# EAGLE design cv10_dobes (EAGLE 7.7.0)
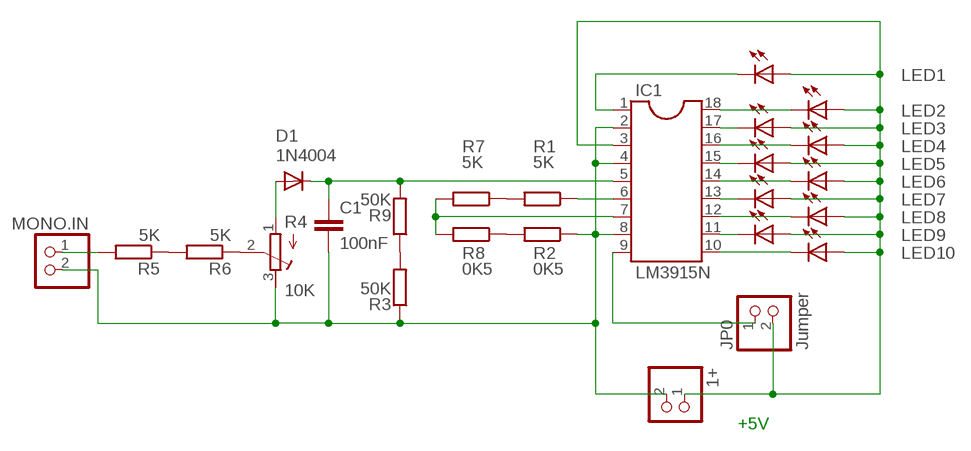
[diagram p0: schematic, sheet 1]

## Parts
1+  PINHD-1X2  [1X02]
C1  100nF  C-EU050-030X075  [C050-030X075]
D1  1N4004  [DO41-10]
IC1  LM3915N  DIL18S  [SOCKET-18]
JP0  Jumper  PINHD-1X2  [1X02]
LED1  LED5MM  [LED5MM]
LED2  LED5MM  [LED5MM]
LED3  LED5MM  [LED5MM]
LED4  LED5MM  [LED5MM]
LED5  LED5MM  [LED5MM]
LED6  LED5MM  [LED5MM]
LED7  LED5MM  [LED5MM]
LED8  LED5MM  [LED5MM]
LED9  LED5MM  [LED5MM]
LED10  LED5MM  [LED5MM]
MONO.IN  PINHD-1X2  [1X02]
R1  5K  R-EU_0207/7  [0207/7]
R2  0K5  R-EU_0207/7  [0207/7]
R3  50K  R-EU_0207/7  [0207/7]
R4  10K  R-TRIMM64P  [RTRIM64P]
R5  5K  R-EU_0207/7  [0207/7]
R6  5K  R-EU_0207/7  [0207/7]
R7  5K  R-EU_0207/7  [0207/7]
R8  0K5  R-EU_0207/7  [0207/7]
R9  50K  R-EU_0207/7  [0207/7]

## Nets
N$1: MONO.IN.1 R5.2
N$2: R4.2(S) R6.1
N$3: D1.A R4.1(E)
N$4: C1.1 D1.C IC1.5 R9.2
N$5: IC1.7 R7.2 R8.2
N$6: IC1.9 JP0.1
N$7: IC1.6 R1.1
N$8: R5.1 R6.2
N$9: 1+.2 C1.2 IC1.2 IC1.4 IC1.8 MONO.IN.2 R2.1 R3.1 R4.3(A)
N$10: 1+.1 IC1.3 JP0.2 LED1.A LED2.A LED3.A LED4.A LED5.A LED6.A LED7.A LED8.A LED9.A LED10.A
N$11: IC1.1 LED1.K(C)
N$12: IC1.18 LED2.K(C)
N$13: IC1.17 LED3.K(C)
N$14: IC1.16 LED4.K(C)
N$15: IC1.15 LED5.K(C)
N$16: IC1.14 LED6.K(C)
N$17: IC1.13 LED7.K(C)
N$18: IC1.12 LED8.K(C)
N$19: IC1.11 LED9.K(C)
N$20: IC1.10 LED10.K(C)
N$21: R2.2 R8.1
N$22: R1.2 R7.1
N$23: R3.2 R9.1

## Notes on the sheet
- +5V

## Library data of the parts
1+ JP0 MONO.IN = pinhead:PINHD-1X2: PIN HEADER
C1 = rcl:C-EU: CAPACITOR, European symbol
D1 = diode:1N4004: DIODE general purpose rectifier, 1 A
IC1 = ic-package:DIL18: Dual In Line / Socket
LED1-LED10 = led:LED: LED OSRAM: - CHIPLED LG R971, LG N971, LY N971, LG Q971, LY Q971, LO R971, LY R971 LH N974, LH R974 LS Q976, LO Q976, LY Q976 LO Q996 - Hyper CHIPLED LW Q18S LB Q993, LB Q99A, LB R99A - SideLED LS A670, LO A670, LY A670, LG A670, LP A670 LB A673, LV A673, LT A673, LW A673 LH A674 LY A675 LS A676, LA A676, LO A676, LY A676, LW A676 LS A679, LY A679, LG A679 - Hyper Micro SIDELED® LS Y876, LA Y876, LO Y876, LY Y876 LT Y87S - SmartLED LW L88C, LW L88S LB L89C, LB L89S, LG L890 LS L89K, LO L89K, LY L89K LS L896, LA L896, LO L896, LY L896 - TOPLED LS T670, LO T670, LY T670, LG T670, LP T670 LSG T670, LSP T670, LSY T670, LOP T670, LYG T670 LG T671, LOG T671, LSG T671 LB T673, LV T673, LT T673, LW T673 LH T674 LS T676, LA T676, LO T676, LY T676, LB T676, LH T676, LSB T676, LW T676 LB T67C, LV T67C, LT T67C, LS T67K, LO T67K, LY T67K, LW E67C LS E67B, LA E67B, LO E67B, LY E67B, LB E67C, LV E67C, LT E67C LW T67C LS T679, LY T679, LG T679 LS T770, LO T770, LY T770, LG T770, LP T770 LB T773, LV T773, LT T773, LW T773 LH T774 LS E675, LA E675, LY E675, LS T675 LS T776, LA T776, LO T776, LY T776, LB T776 LHGB T686 LT T68C, LB T68C - Hyper Mini TOPLED® LB M676 - Mini TOPLED Santana® LG M470 LS M47K, LO M47K, LY M47K Source: http://www.osram.convergy.de LUXEON: - LUMILED® LXK2-PW12-R00, LXK2-PW12-S00, LXK2-PW14-U00, LXK2-PW14-V00 LXK2-PM12-R00, LXK2-PM12-S00, LXK2-PM14-U00 LXK2-PE12-Q00, LXK2-PE12-R00, LXK2-PE12-S00, LXK2-PE14-T00, LXK2-PE14-U00 LXK2-PB12-K00, LXK2-PB12-L00, LXK2-PB12-M00, LXK2-PB14-N00, LXK2-PB14-P00, LXK2-PB14-Q00 LXK2-PR12-L00, LXK2-PR12-M00, LXK2-PR14-Q00, LXK2-PR14-R00 LXK2-PD12-Q00, LXK2-PD12-R00, LXK2-PD12-S00 LXK2-PH12-R00, LXK2-PH12-S00 LXK2-PL12-P00, LXK2-PL12-Q00, LXK2-PL12-R00 Source: www.luxeon.com KINGBRIGHT: KA-3528ASYC Source: www.kingbright.com
R1-R3 R5-R9 = rcl:R-EU_: RESISTOR, European symbol
R4 = rcl:R-TRIMM: Trimm resistor

## Board
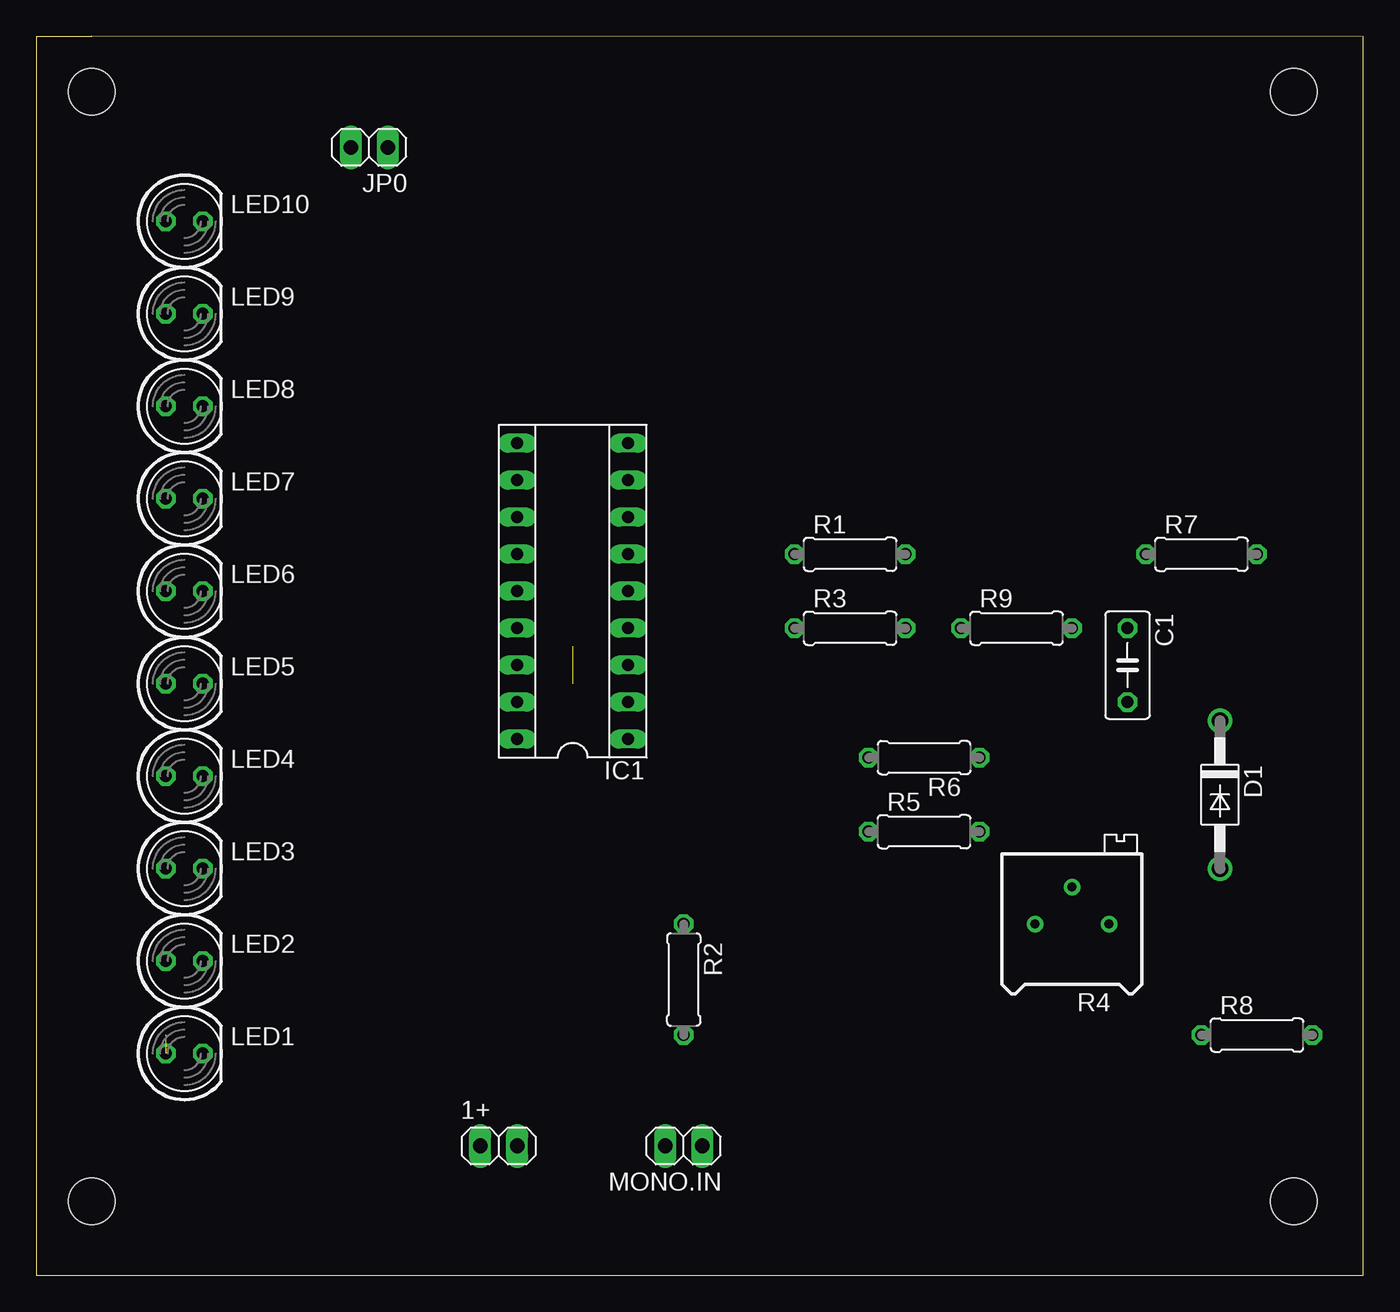
[diagram p1: board, top side]
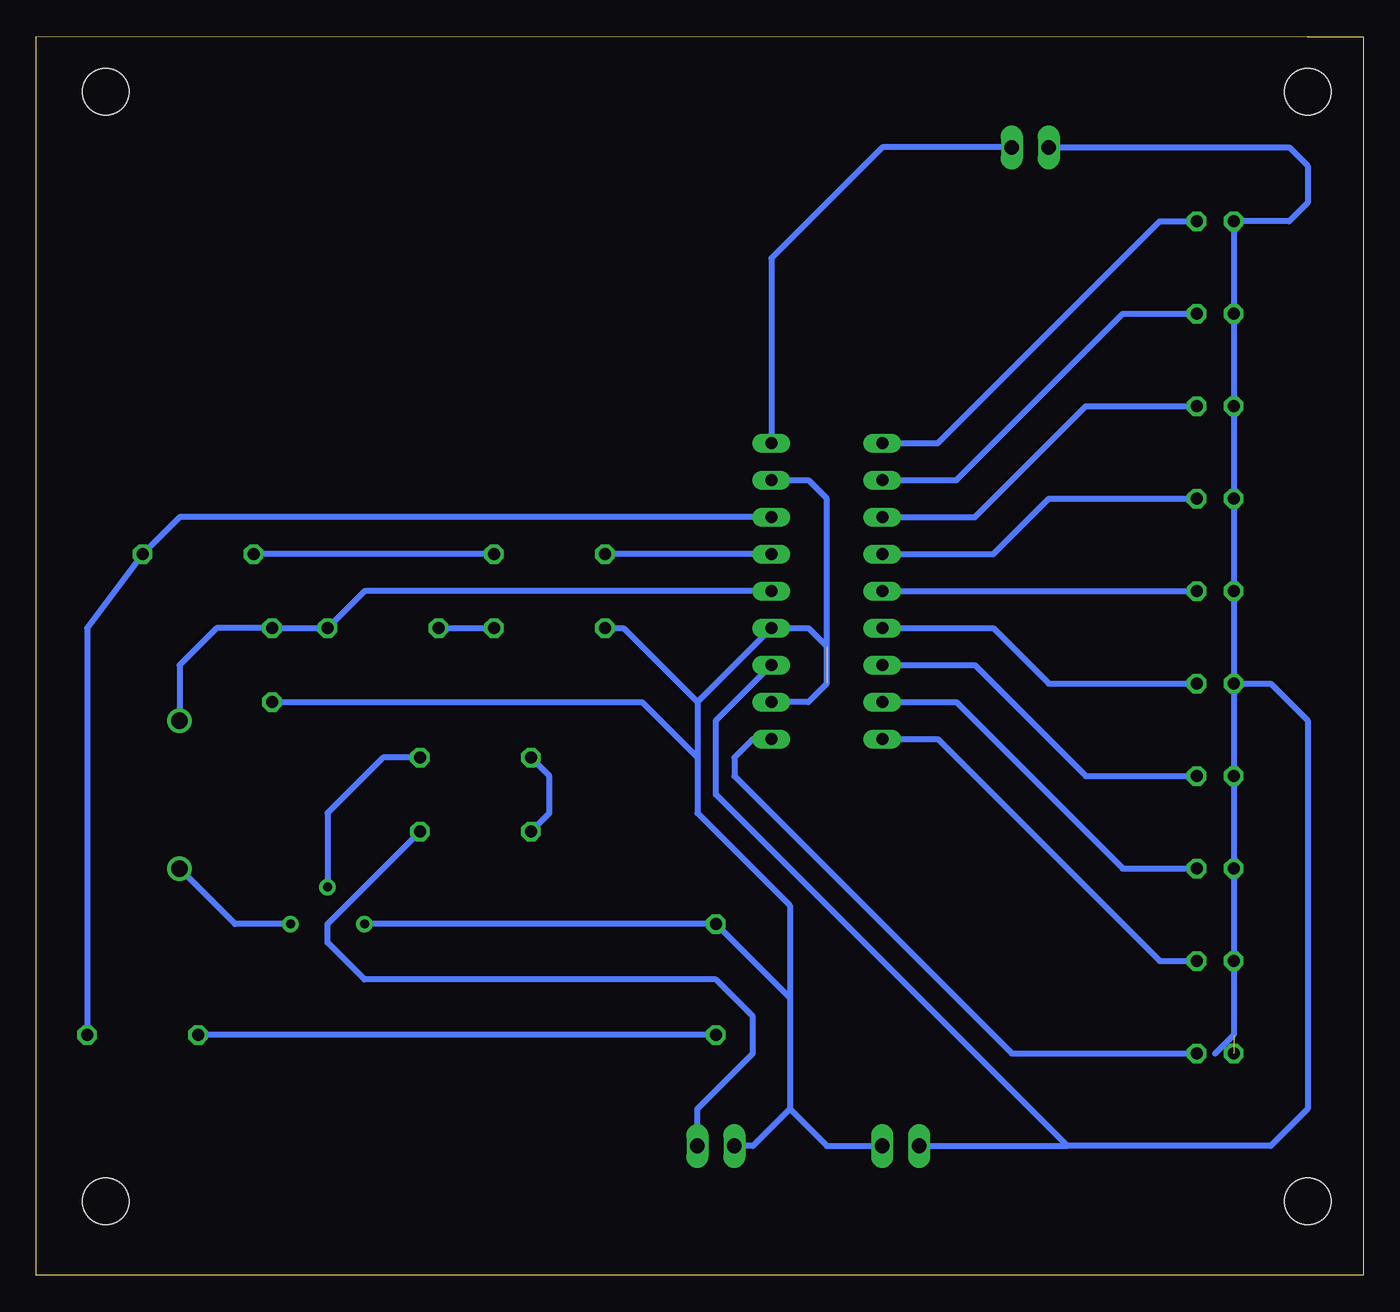
[diagram p2: board, bottom side, seen from below]

Size 91.11 x 85.09 mm. Coordinates in mm from the lower left corner, seen from the top.
Outline: 0,0 91.11,0 91.11,85.08 3.81,85.09 3.81,85.08 0,85.08 0,0
Copper layers (1*16): Top 0.035mm / dielectric 1.5mm / Bottom 0.035mm
Design rules "default": minimum track width 10mil, minimum drill 24mil, track to track 8mil, track to pad 8mil, pad to pad 8mil, via to via 8mil, smd to smd 8mil, copper to edge 40mil, drill to drill 8mil, minimum pad ring 10mil, minimum via ring 8mil, stop-mask expansion 4mil, vias tented up to drill 0mil, thermal gap 10mil
Holes 3.2 mm at 3.81,81.28 86.36,81.28 86.36,5.08 3.81,5.08

### Footprints (pad centres in the part's own frame; a part is rotated, then mirrored left to right if it is on the bottom)
1X02 = drill 1.016 long: 1 -1.27,0; 2 1.27,0
C050-030X075 = drill 0.813 octagon: 1 -2.54,0; 2 2.54,0
DO41-10 = drill 1.118: A 5.08,0; C -5.08,0
SOCKET-18 = drill 0.813 long: 1 -10.16,-3.81; 2 -7.62,-3.81; 3 -5.08,-3.81; 4 -2.54,-3.81; 5 0,-3.81; 6 2.54,-3.81; 7 5.08,-3.81; 8 7.62,-3.81; 9 10.16,-3.81; 10 10.16,3.81; 11 7.62,3.81; 12 5.08,3.81; 13 2.54,3.81; 14 0,3.81; 15 -2.54,3.81; 16 -5.08,3.81; 17 -7.62,3.81; 18 -10.16,3.81
LED5MM = drill 0.813 octagon: A -1.27,0; K 1.27,0
0207/7 = drill 0.813 octagon: 1 -3.81,0; 2 3.81,0
RTRIM64P = drill 0.61: 1 0,-2.54; 2 2.54,0; 3 0,2.54

### Placement (x,y rotation side)
1+  31.75,8.89 0 top
C1  74.93,41.91 270 top
D1  81.28,33.02 270 top
IC1  36.83,46.99 90 top
JP0  22.86,77.47 180 top
LED1  10.16,15.24 0 top
LED2  10.16,21.59 0 top
LED3  10.16,27.94 0 top
LED4  10.16,34.29 0 top
LED5  10.16,40.64 0 top
LED6  10.16,46.99 0 top
LED7  10.16,53.34 0 top
LED8  10.16,59.69 0 top
LED9  10.16,66.04 0 top
LED10  10.16,72.39 0 top
MONO.IN  44.45,8.89 180 top
R1  55.88,49.53 0 top
R2  44.45,20.32 270 top
R3  55.88,44.45 0 top
R4  71.12,24.13 90 top
R5  60.96,30.48 0 top
R6  60.96,35.56 180 top
R7  80.01,49.53 0 top
R8  83.82,16.51 0 top
R9  67.31,44.45 0 top

### Tracks (layer width: path | path; a pad name or v marks a point on that pad's centre or on a via)
N$1
  Bottom 0.406: MONO.IN.1 45.72,11.43 41.91,15.24 41.91,17.78 44.45,20.32 68.58,20.32 71.12,22.86 71.12,24.13 R5.2
N$2
  Bottom 0.406: R6.1 67.31,35.56 71.12,31.75 R4.2
N$3
  Bottom 0.406: R4.1 77.47,24.13 D1.A
N$4
  Bottom 0.406: D1.C 81.28,41.91 78.74,44.45 C1.1 R9.2 68.58,46.99 IC1.5
N$5
  Bottom 0.406: R8.2 87.63,44.45 R7.2 81.28,52.07 IC1.7
N$6
  Bottom 0.406: JP0.1 33.02,77.47 40.64,69.85 IC1.9
N$7
  Bottom 0.406: IC1.6 R1.1
N$8
  Bottom 0.406: R5.1 55.88,31.75 55.88,34.29 R6.2
N$9  (1 unrouted)
  Bottom 0.406: 45.72,39.37 IC1.4 38.1,44.45 36.83,43.18 36.83,45.72 | R3.1 50.8,44.45 45.72,39.37 | 45.72,39.37 45.72,35.56 | 39.37,11.43 36.83,8.89 1+.2 | 39.37,19.05 R2.1 R4.3 | 39.37,19.05 39.37,11.43 | C1.2 49.53,39.37 45.72,35.56 | 45.72,35.56 45.72,31.75 39.37,25.4 39.37,19.05 | 39.37,11.43 41.91,8.89 MONO.IN.2 | IC1.8 38.1,54.61 36.83,53.34 36.83,40.64 38.1,39.37 IC1.2
N$10  (1 unrouted)
  Bottom 0.406: LED5.A LED6.A LED7.A LED8.A LED9.A LED10.A 5.08,72.39 3.81,73.66 3.81,76.2 5.08,77.47 JP0.2 | LED5.A LED4.A LED3.A LED2.A 8.89,16.51 10.16,15.24 | 1+.1 20.32,8.89 | LED5.A 6.35,40.64 3.81,38.1 3.81,11.43 6.35,8.89 20.32,8.89 | 20.32,8.89 44.45,33.02 44.45,38.1 IC1.3
N$11
  Bottom 0.406: IC1.1 41.91,36.83 43.18,35.56 43.18,34.29 24.13,15.24 LED1.K
N$12
  Bottom 0.406: IC1.18 29.21,36.83 13.97,21.59 LED2.K
N$13
  Bottom 0.406: IC1.17 27.94,39.37 16.51,27.94 LED3.K
N$14
  Bottom 0.406: IC1.16 26.67,41.91 19.05,34.29 LED4.K
N$15
  Bottom 0.406: IC1.15 25.4,44.45 21.59,40.64 LED5.K
N$16
  Bottom 0.406: IC1.14 LED6.K
N$17
  Bottom 0.406: IC1.13 25.4,49.53 21.59,53.34 LED7.K
N$18
  Bottom 0.406: IC1.12 26.67,52.07 19.05,59.69 LED8.K
N$19
  Bottom 0.406: IC1.11 27.94,54.61 16.51,66.04 LED9.K
N$20
  Bottom 0.406: IC1.10 29.21,57.15 13.97,72.39 LED10.K
N$21
  Bottom 0.406: R2.2 R8.1
N$22
  Bottom 0.406: R1.2 R7.1
N$23
  Bottom 0.406: R9.1 R3.2